# Altium schematic sheet Sheet1.SchDoc: Digital Alarm Clock
size Letter; SheetNumber: 1; SheetTotal: 1
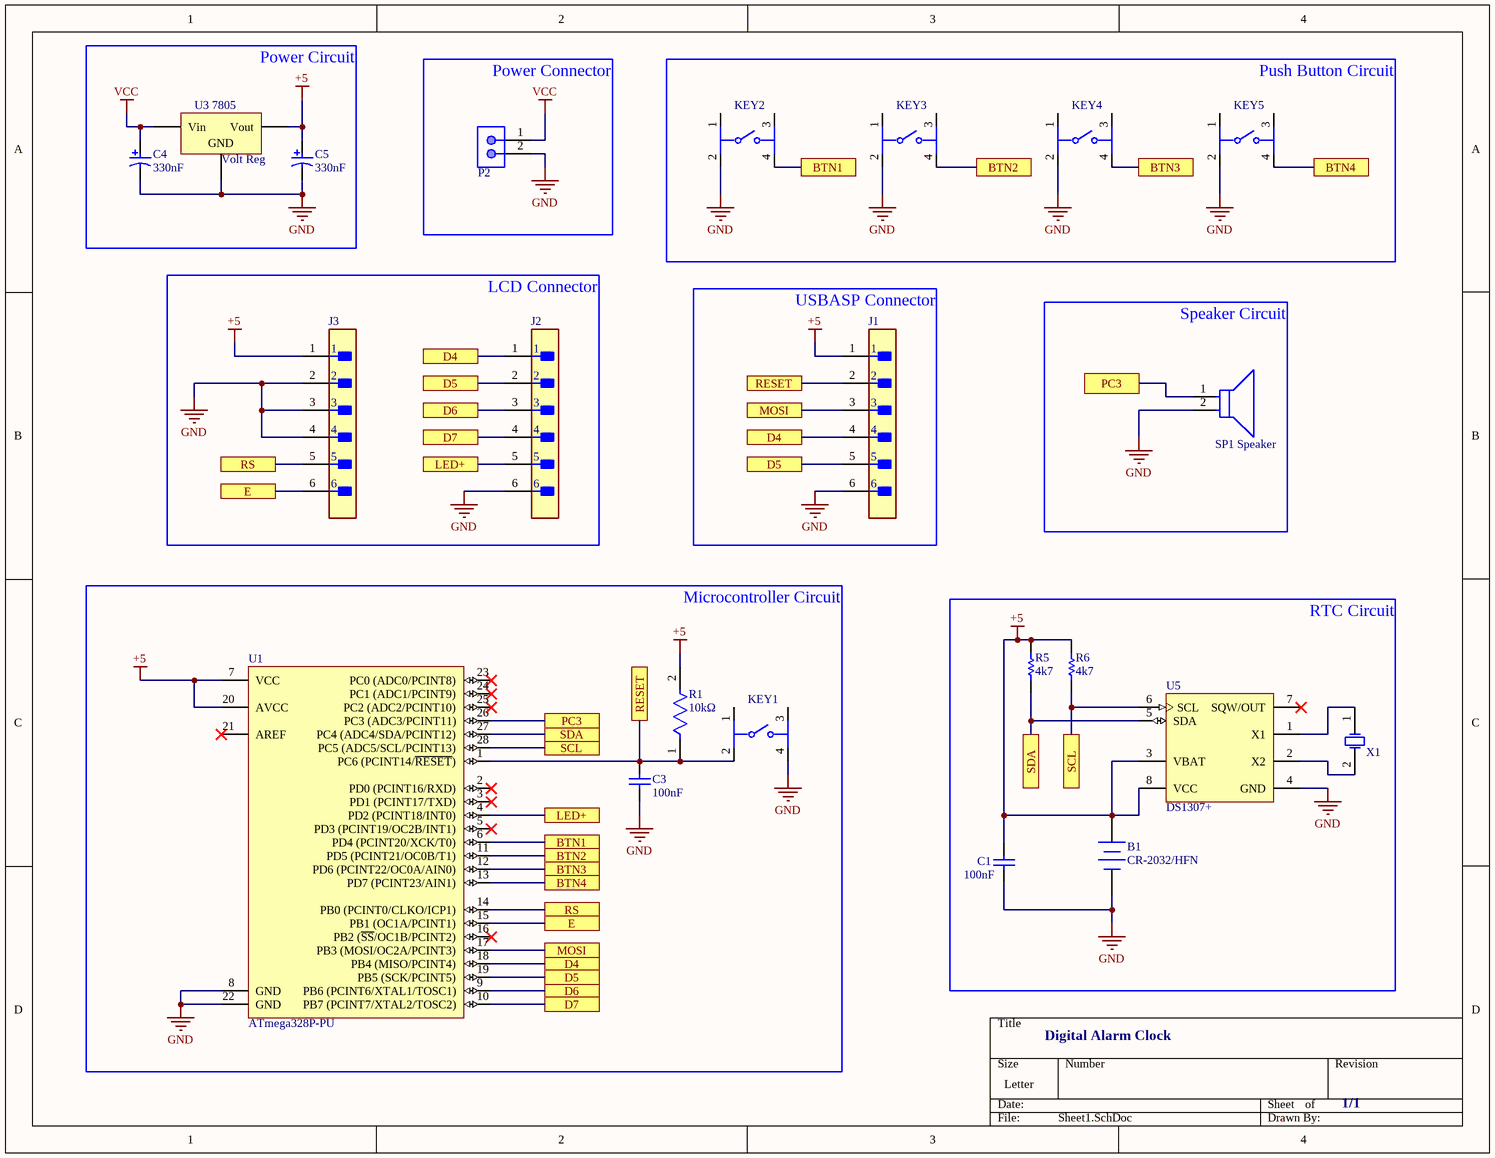
[diagram p0: Sheet1.SchDoc]

## Parts
?  SP1 Speaker  [FP-CVS-1508-MFG]
B1  CR-2032/HFN  [PANA-CR-2032HFN]
C1  Capacitance: 100nF  [AVX-MD01]  (hidden comment: MD015E104MAB)
C3  Capacitance: 100nF  [AVX-MD01]  (hidden comment: MD015E104MAB)
C4  Capacitance: 330nF  [KEMT-T491-C_L]  (hidden comment: T491C106K016AT)
C5  Capacitance: 330nF  [KEMT-T491-C_L]  (hidden comment: T491C106K016AT)
J1  530470610  [FP-530470610-MFG]  (value not drawn)
J2  530470610  [FP-530470610-MFG]  (value not drawn)
J3  530470610  [FP-530470610-MFG]  (value not drawn)
KEY1  B3F-1005  [FP-B3F-1005-MFG]  (value not drawn)
KEY2  B3F-1005  [FP-B3F-1005-MFG]  (value not drawn)
KEY3  B3F-1005  [FP-B3F-1005-MFG]  (value not drawn)
KEY4  B3F-1005  [FP-B3F-1005-MFG]  (value not drawn)
KEY5  B3F-1005  [FP-B3F-1005-MFG]  (value not drawn)
P2  5-146280-2  [TECO-5-146280-2_V]  (value not drawn)
R1  Resistance: 10kΩ  [FP-RNC55-MFG]  (hidden comment: RNC55H1002FSB14)
R5  Resistance: 4k7  [RESC1005X37X25NL05T10]  (hidden comment: RE0402DR-074K7L)
R6  Resistance: 4k7  [RESC1005X37X25NL05T10]  (hidden comment: RE0402DR-074K7L)
U1  ATmega328P-PU  [28P3]
U3_7805  Volt Reg  [D2PAK_N]
U5  DS1307+  [P8+2]
X1  ABLS-8.000MHZ-B4-T  [ABRA-ABLS-14.7456MHZ-B2-T_V]  (value not drawn)

## Ports
BTN1, BTN2, BTN3, BTN4, D4, D5, D6, D7, E, LED+, MOSI, PC3, RESET, RS, SCL, SDA

## Nets
+5: B1.1(+) C1.2 C5.1 J1.1 J3.1 R1.2 R5.2 R6.2 U1.7(VCC) U1.20(AVCC) U3_7805.3(Vout) U5.3(VBAT) U5.8(VCC)
GND: ?.2(A) B1.2(-) C1.1 C3.1 C4.2 C5.2 J1.6 J2.6 J3.2 J3.3 J3.4 KEY1.4 KEY2.2 KEY3.2 KEY4.2 KEY5.2 P2.2 U1.8(GND) U1.22(GND) U3_7805.2(GND) U5.4(GND)
VCC: C4.1 P2.1 U3_7805.1(Vin)
BTN1: KEY2.4 U1.6(PD4_(PCINT20/XCK/T0)) ; port BTN1
BTN2: KEY3.4 U1.11(PD5_(PCINT21/OC0B/T1)) ; port BTN2
BTN3: KEY4.4 U1.12(PD6_(PCINT22/OC0A/AIN0)) ; port BTN3
BTN4: KEY5.4 U1.13(PD7_(PCINT23/AIN1)) ; port BTN4
D4: J1.4 J2.1 U1.18(PB4_(MISO/PCINT4)) ; port D4
D5: J1.5 J2.2 U1.19(PB5_(SCK/PCINT5)) ; port D5
D6: J2.3 U1.9(PB6_(PCINT6/XTAL1/TOSC1)) ; port D6
D7: J2.4 U1.10(PB7_(PCINT7/XTAL2/TOSC2)) ; port D7
E: J3.6 U1.15(PB1_(OC1A/PCINT1)) ; port E
LED+: J2.5 U1.4(PD2_(PCINT18/INT0)) ; port LED+
MOSI: J1.3 U1.17(PB3_(MOSI/OC2A/PCINT3)) ; port MOSI
PC3: ?.1(C) U1.26(PC3_(ADC3/PCINT11)) ; port PC3
RESET: C3.2 J1.2 KEY1.2 R1.1 U1.1(PC6_(PCINT14/~{RESET})) ; port RESET
RS: J3.5 U1.14(PB0_(PCINT0/CLKO/ICP1)) ; port RS
SCL: R6.1 U1.28(PC5_(ADC5/SCL/PCINT13)) U5.6(SCL) ; port SCL
SDA: R5.1 U1.27(PC4_(ADC4/SDA/PCINT12)) U5.5(SDA) ; port SDA
NetU5_1: U5.1(X1) X1.1(X1)
NetU5_2: U5.2(X2) X1.2(X2)

Not connected (* = marked no-connect by the designer): KEY1 1 3; KEY2 1 3; KEY3 1 3; KEY4 1 3; KEY5 1 3; U1 2(PD0_(PCINT16/RXD))* 3(PD1_(PCINT17/TXD))* 5(PD3_(PCINT19/OC2B/INT1))* 16(PB2_(~{SS}/OC1B/PCINT2))* 21(AREF)* 23(PC0_(ADC0/PCINT8))* 24(PC1_(ADC1/PCINT9))* 25(PC2_(ADC2/PCINT10))*; U5 7(SQW/OUT)*

## Notes on the sheet
- (near P2) Power Connector
- Power Circuit
- Push Button Circuit
- LCD Connector
- (near J1) USBASP Connector
- Speaker Circuit
- RTC Circuit
- Digital Alarm Clock
- Microcontroller Circuit
- 1/1

## Library data of the parts
? = CMP-14846-000001-1: SPEAKER 8OHM 300MW TOP PORT 87DB; Manufacturer: CUI Inc; Resistance: 8Ω; Value: 8Ω; Frequency: 1700Hz; Package: CVS-1508; Device Class L1: Electromechanical; Manufacturer Part Number: CVS-1508; Mouser Description: Speakers & Transducers Speakers; Temperature Range High: +55°C; Octopart: https://octopart.com/cvs-1508-cui-21325683; Device Class L2: Audio Products; Temperature Range Low: -20°C; Category: Speak; Digikey Description: SPEAKER 8OHM 300MW TOP PORT 87DB; Temperature: -20°C to +55°C; Height: 8mm; ComponentLink2Description: Datasheet; ComponentLink2URL: https://www.cui.com/product/resource/cvs-1508.pdf; Device Class L3: Speakers; Lead Free: Yes; RoHS: TRUE; Automotive: No
B1 = CMP-2000-05296-1: Coin Cell Battery, 225 mAh, 0.2 mA, 3 V, -30 to 60 degC, Bulk; Manufacturer: Panasonic; SVHC: 1,2-dimethoxyethane,ethyleneglycoldimethylether(EGDME)(15-Jun-2015); Battery Size Code: 2032; Battery Voltage: 3V; Battery IEC Code: CR2032; Battery NEDA Code: 5004LC; External Height: 3.2mm; Battery Terminals: PCBPins; Battery Capacity: 220mAh; External Diameter: 20mm; Battery Technology: LithiumManganeseDioxide; Product Range: -; Datasheet Version: Rev. 0, 05/2010; Manufacturer URL: http://www.panasonic.com/; External Depth: -; Weight: 2.9g; Datasheet URL: https://datasheet.ciiva.com/3/aaa4000de87-3072.pdf; External Width: -
C1 C3 = CMP-2000-06690-1: Ceramic Capacitor, 0.1 uF, +/- 20%, 50 V, -55 to 125 degC, 2-Pin THD (MD01), Bulk; Manufacturer: AVX; Dielectric: Z5U; Rated Voltage: 50V; Mounting Technology: ThroughHole; Case Size/Dimension: 6.6x3.43x2.54mm; Package Reference: AVX-MD01; Datasheet URL: http://datasheets.avx.com/dipguard.pdf; Package Description: 2-Pin Through Hole Device, Body 6.6 x 2.54 mm; Datasheet Version: 08/2015; Tolerance (%): ±20%; Manufacturer URL: http://www.avx.com/
C4 C5 = CMP-2000-07197-1: Tantalum Capacitor, 10 uF, +/- 10%, 16 V, -55 to 125 degC, 2-Pin SMD (T491-C), RoHS, Tape and Reel; Manufacturer: Kemet; Product Diameter (mm): NotRequiredmm; Product Depth (mm): 3.2mm; ESR: 1.8ohm; Product Length (mm): 6mm; DCL: 1.6uA; Seal: NotRequired; Voltage: 16VDC; DF: 6%; Product Height (mm): 2.5mm; Polarity: Polar; Rad Hardened: No; Case Style: Molded; Datasheet URL: http://capacitoredge.kemet.com/capedge2/DataSheet/Datasheet-T491C106K016AT.pdf?pn=T491C106K016AT; Datasheet Version: 10/2016; Packaging: TapeandReel; Tolerance (+ or -): 10%; Mounting Technology: SurfaceMount; Package Description: 2-Pin Surface Mount Device, Body 6 x 3.2 mm; Manufacturer URL: http://www.kemet.com/; Length W/Weld (max): NotRequiredmm; Lead Spacing (nom): NotRequiredmm; Operating Temp Range: -55Cto125C; Package Reference: T491-C; Mounting Style: SurfaceMount; Length W/Weld: NotRequiredmm; Failure Rate: NotRequired; Wire Form: NotRequired; Package / Case: 6032-28; Insulation: NotRequired; Construction: SMTChip; Seated Plane Height: NotRequiredmm; Case Code: C
J1-J3 = CMP-2000-05476-3: CONN HEADER VERT 6POS 1.25MM; Manufacturer: Molex; Conn Gender: Male; Voltage Rating: 125V; Number Of Contacts: 6; Current Rating: 1A; Conn Orientation: Vertical; Number Of Rows: 1; Package: 0; Height: 4.4mm; Device Class L2: Headers and Wire Housings; RoHS: TRUE; Pitch: 1.25mm; Category: Conn; Device Class L1: Connectors; ComponentLink2URL: https://www.molex.com/webdocs/datasheets/pdf/en-us/0530470610_PCB_HEADERS.pdf; Temperature Range Low: -40°C; Temperature: -40°C to +85°C; Lead Free: Yes; Footprint Url: https://www.molex.com/pdm_docs/sd/530470610_sd.pdf; Temperature Range High: +85°C; Device Class L3: unset; Digikey Description: CONN HEADER VERT 6POS 1.25MM; Automotive: No; Mouser Description: Headers & Wire Housings VERTICAL HDR 6P; ComponentLink2Description: Datasheet; Contact Material: Tin; Manufacturer Part Number: 530470610; Octopart: https://octopart.com/53047-0610-molex-276776
KEY1-KEY5 = CMP-08834-000043-1: SWITCH TACTILE SPST-NO 0.05A 24V; Contact Current Rating: 50mA; Switch Travel: 0.25mm; Mechanical Life: 100000Cycles; Switch Function: Off-Mom; Throw Configuration: SPST; Illumination Type: Non-Illuminated; Actuator Type: Standard; Electrical Life: 300000Cycles; Number of Poles: 1; Ratings: IP00; Actuator Color: Orange; Contact Resistance: 100mR; Operating Force: 2.55N; Actuator Length: 0.9mm; Weight: 0.25g; Max Operating Temperature: 70°C; Packaging: Bag; Depth: 6mm; Package Quantity: 1500; Lead Free: Lead Free; Voltage Rating (DC): 24V; Termination: PC Pins; Length: 6mm; Contact Material: Gold; Min Operating Temperature: -25°C; Mount: Through Hole; Max Voltage Rating (DC): 24V; Current Rating: 50mA; Max Current Rating: 50mA; Orientation: Straight; Width: 6mm; Height: 4.3mm; Series: B3F; Contact Plating: Silver
P2 = CMP-2000-07492-1: Male Header, Pitch 2.54 mm, 1 x 2 Position, Height 8.21 mm, Tail Length 3.05 mm, -65 to 105 degC, RoHS, Bulk; Manufacturer: TE Connectivity; Mating Connector Lock: No(Without); Number of Positions: 2; Pitch: 2.54mm; PCB Mounting Orientation: Vertical; Keyed: No; Case\/Package: 100; Mating Post Length: 0.23inch; High Temperature Housing: Yes; Max Current Rating: 5A; PCB Thickness: 0.063inch; PCB Mount Retention: Without; Approvals: CSA; Current Rating: 3A; Radiation Hardening: No; Length: 4.67mm; Contact Mating Length: 0.23inch; Connector Type: Header; Number of Rows: 1; Termination Post Length: 0.12inch; Board Standoff: No(Without); Max Operating Temperature: 105degC; Contact Shape: Square; Selectively Loaded: No(Without); Gasket: No(Without); Number of Contacts: 2; Contact Gender: Male; Mating Alignment: No(Without); Manufacturer URL: http://www.te.com/; Datasheet URL: http://www.te.com/commerce/DocumentDelivery/DDEController?Action=showdoc&DocId=Customer+Drawing%7F146280%7FH1%7Fpdf%7FEnglish%7FENG_CD_146280_H1.pdf%7F5-146280-2; Mount: ThroughHole; Orientation: Straight; Packaging: Carton; Package Reference: 5-146280-2; Package Quantity: 500; Stabilizers: No(Without); Row Spacing: 2.54mm; Contact Material: CopperAlloy; Panel Mount Retention: No(Without); Datasheet Version: Rev. H1, 08/2016; Housing Colour: Black; Colour: Black; Package Description: Male Header, Pitch 2.54 mm, 1 x 2 Position, Height 8.21 mm, Tail Length 3.05 mm; Contact Plating: Matte; Housing Material: Polymer; Contact Protection: No(Without); Min Operating Temperature: -65degC; Mounting Technology: ThroughHole; Flammability Rating: UL94V-0; RoHSCompliant: true; Termination: ThroughHole; Depth: 2.34mm; High Speed Serial Data Connector: No
R1 = CMP-02408-000004-1: RES 10K OHM 1/8W 1% AXIAL; Manufacturer: Vishay; Voltage Rating: 200V; Power Rating: 0.125W; Temperature Coefficient: 50ppm/°C; Value: 10kΩ; Automotive: No; Category: Res; Tolerance: 1%; Temperature: -65°C to +175°C; Device Class L2: Resistors; Composition: Metal Film; Height: 2.69mm; Failure Rate: 0.001%; ComponentLink2URL: https://www.vishay.com/docs/31025/erc.pdf; Manufacturer Part Number: RNC55H1002FSB14; Temperature Range High: +175°C; Lead Free: No; Series: RNC; Device Class L1: Passive Components; Ipc Land Pattern Name: RESAD1100W85L762D269; Octopart: https://octopart.com/rnc55h1002fs-vishay-40848808; Package: RNC55; RoHS: FALSE; Military Standard: true; Device Class L3: Through-Hole Resistors; ComponentLink2Description: Datasheet; Digikey Description: RES 10K OHM 1/8W 1% AXIAL; Temperature Range Low: -65°C
R5 R6 = CMP-2002-01865-1: Manufacturer: Yageo / Phycomp; Part Number: RE0402DR-074K7L
U1 = CMP-0095-00013-2: 8-bit AVR Microcontroller, 32KB Flash, 1KB EEPROM, 2KB SRAM, 28-pin PDIP, Industrial Grade (-40°C to 85°C); RevisionNote: DatasheetVersion updated. URLs added.; PackageVersion: revB, Sep-2001; PackageDescription: 28-lead (0.300"/7.62mm Wide) Plastic Dual Inline Package (PDIP); DatasheetVersion: revD, May-2011; ComponentLink1Description: Manufacturer URL; ComponentLink1URL: http://www.atmel.com/; PackageReference: 28P3; ComponentLink2Description: ATmega48A/48PA/88A/88PA/168A/168PA/328/328P Datasheet; ComponentLink3URL: http://www.atmel.com/dyn/resources/prod_documents/8271S.pdf; ComponentLink2URL: http://www.atmel.com/dyn/resources/prod_documents/8271.pdf; ComponentLink3Description: ATmega48A/48PA/88A/88PA/168A/168PA/328/328P Summary
U3_7805 = Volt Reg: Voltage Regulator; Published: 24-Mar-1999; LatestRevisionDate: 29-May-2009; LatestRevisionNote: IPC-7351 Footprint Added.; PackageReference: D2PAK; Publisher: Altium Limited; PackageDescription: 3-Pin Transistor Outline Package 2.54 mm Pitch, 15.1 mm Lead Span
U5 = CMP-0254-00152-1: 64 x 8, Serial, I2C Real-Time Clock, 5.0V, 8-Pin PDIP, 0 to 70 degC, Pb-Free; ComponentLink2URL: http://datasheets.maxim-ic.com/en/ds/DS1307.pdf; ComponentLink3URL: http://pdfserv.maxim-ic.com/package_dwgs/21-0043.PDF; ComponentLink1Description: Manufacturer URL; PackageVersion: revE, 2011; ComponentLink1URL: http://www.maxim-ic.com; PackageDescription: 8-Pin Plastic Dual-In-Line, Narrow (0.3in), Pitch 2.54 mm, PDIP(N), Pb-Free; ComponentLink2Description: Datasheet; Code_JEDEC: MS-001-AB; PackageReference: P8+2; DatasheetVersion: 10-Feb-2008; ComponentLink3Description: Package Specification
X1 = CMP-2000-05726-1: Low Profile Crystal, 8.0 MHz, +/- 30 ppm, -20 to 70 degC, 2-Pin SMD, RoHS, Tape and Reel; Brand: ABRACON; Case Length: 11.4mm; Frequency Stability: 50PPM; ESR: 80Ohms; Case Height: 4.2mm; Tolerance: 30PPM; Frequency: 8MHz; Case Width: 4.7mm; Load Capacitance: 18pF; Datasheet Version: 04/2011; Termination Style: SMD/SMT; Dimensions: 4.7mmWx11.4mmLx4.2mmH; Packaging: Reel; Manufacturer: ABRACON; Package URL: http://www.abracon.com/Support/PackageDrawing/Resonators/ABLS-2D.pdf; Mounting Technology: SurfaceMount; Package Reference: ABLS-14.7456MHZ-B2-T; Product Category: Crystals; Package Description: 2-Pin Surface Mount Device, Body 11.4 x 4.7 mm; Package / Case: HC-49/US; Mounting Style: SMD/SMT; Operating Temperature Range: -20Cto+70C; Series: ABLS; Factory Pack Quantity: 1000; Datasheet URL: http://www.abracon.com/Resonators/abls.pdf; Manufacturer URL: http://www.abracon.com/; RoHS: Details; Type: LowProfileMicroprocessorCrystal